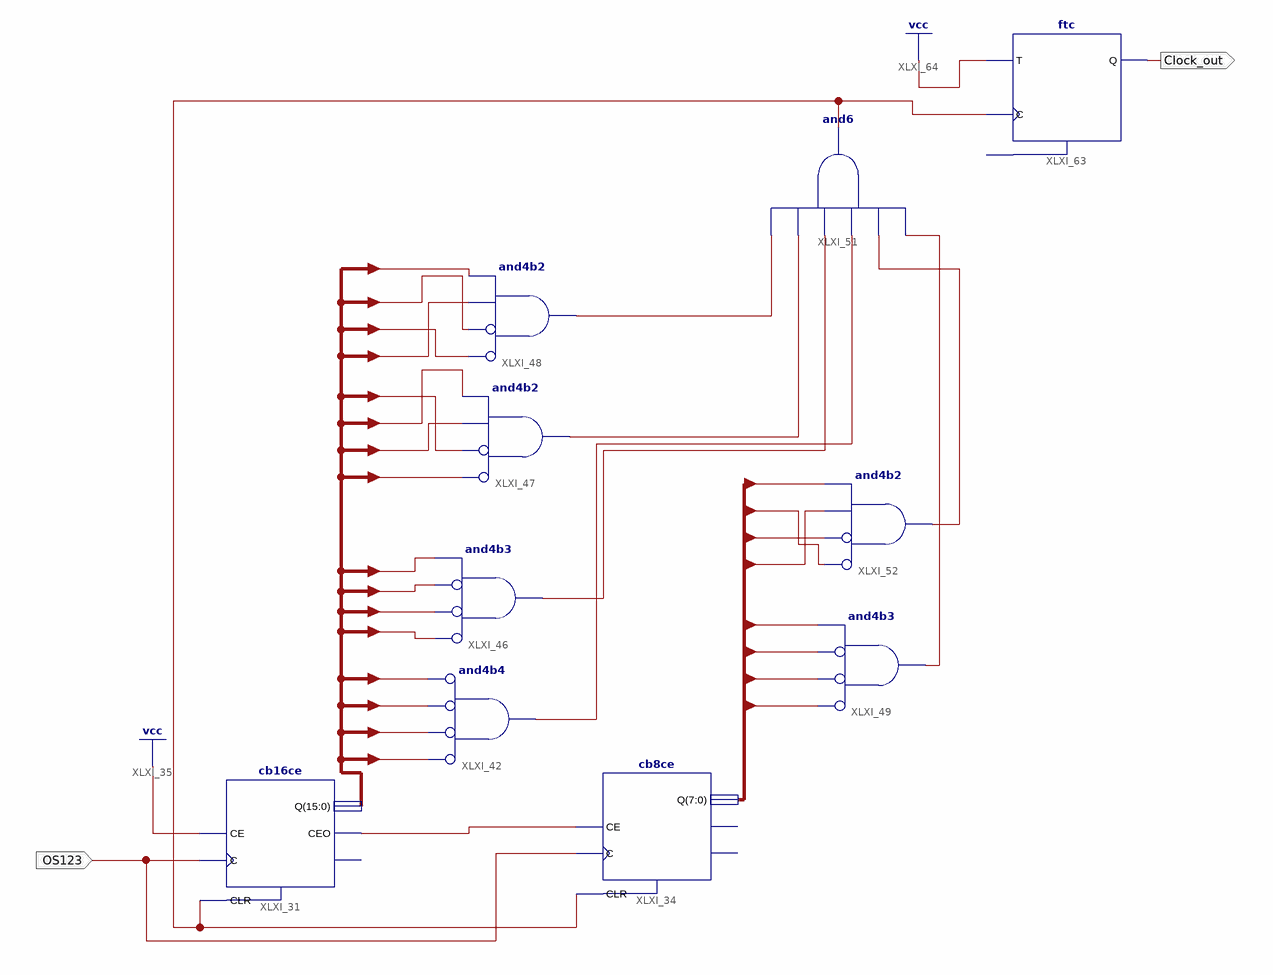
[diagram p0: schematic sheet 1]
// Xilinx ISE schematic clockdivtest.sch (spartan6) as structural Verilog: 10 symbols, 2 ports
module clockdivtest (
  input  OS123,
  output Clock_out
);

  wire XLXN_42, XLXN_95, XLXN_96, XLXN_97, XLXN_98, XLXN_99, XLXN_100, XLXN_141;
  wire [7:0] Q1;
  wire [15:0] Q;

  cb16ce XLXI_31 (.C(OS123), .CE(1'b1), .CLR(XLXN_141), .CEO(XLXN_42), .Q(Q));  // open: TC
  cb8ce XLXI_34 (.C(OS123), .CE(XLXN_42), .CLR(XLXN_141), .Q(Q1));  // open: CEO, TC
  and XLXI_42 (XLXN_98, ~Q[0], ~Q[1], ~Q[2], ~Q[3]);  // and4b4
  and XLXI_46 (XLXN_97, ~Q[4], ~Q[5], ~Q[6], Q[7]);  // and4b3
  and XLXI_47 (XLXN_96, ~Q[8], ~Q[11], Q[9], Q[10]);  // and4b2
  and XLXI_48 (XLXN_95, ~Q[13], ~Q[14], Q[12], Q[15]);  // and4b2
  and XLXI_49 (XLXN_100, ~Q1[0], ~Q1[1], ~Q1[2], Q1[3]);  // and4b3
  and XLXI_51 (XLXN_141, XLXN_100, XLXN_99, XLXN_98, XLXN_97, XLXN_96, XLXN_95);
  and XLXI_52 (XLXN_99, ~Q1[6], ~Q1[5], Q1[4], Q1[7]);  // and4b2
  ftc XLXI_63 (.C(XLXN_141), .T(1'b1), .Q(Clock_out));  // open: CLR
endmodule
